# Altium project Daughterboard.PrjPcb
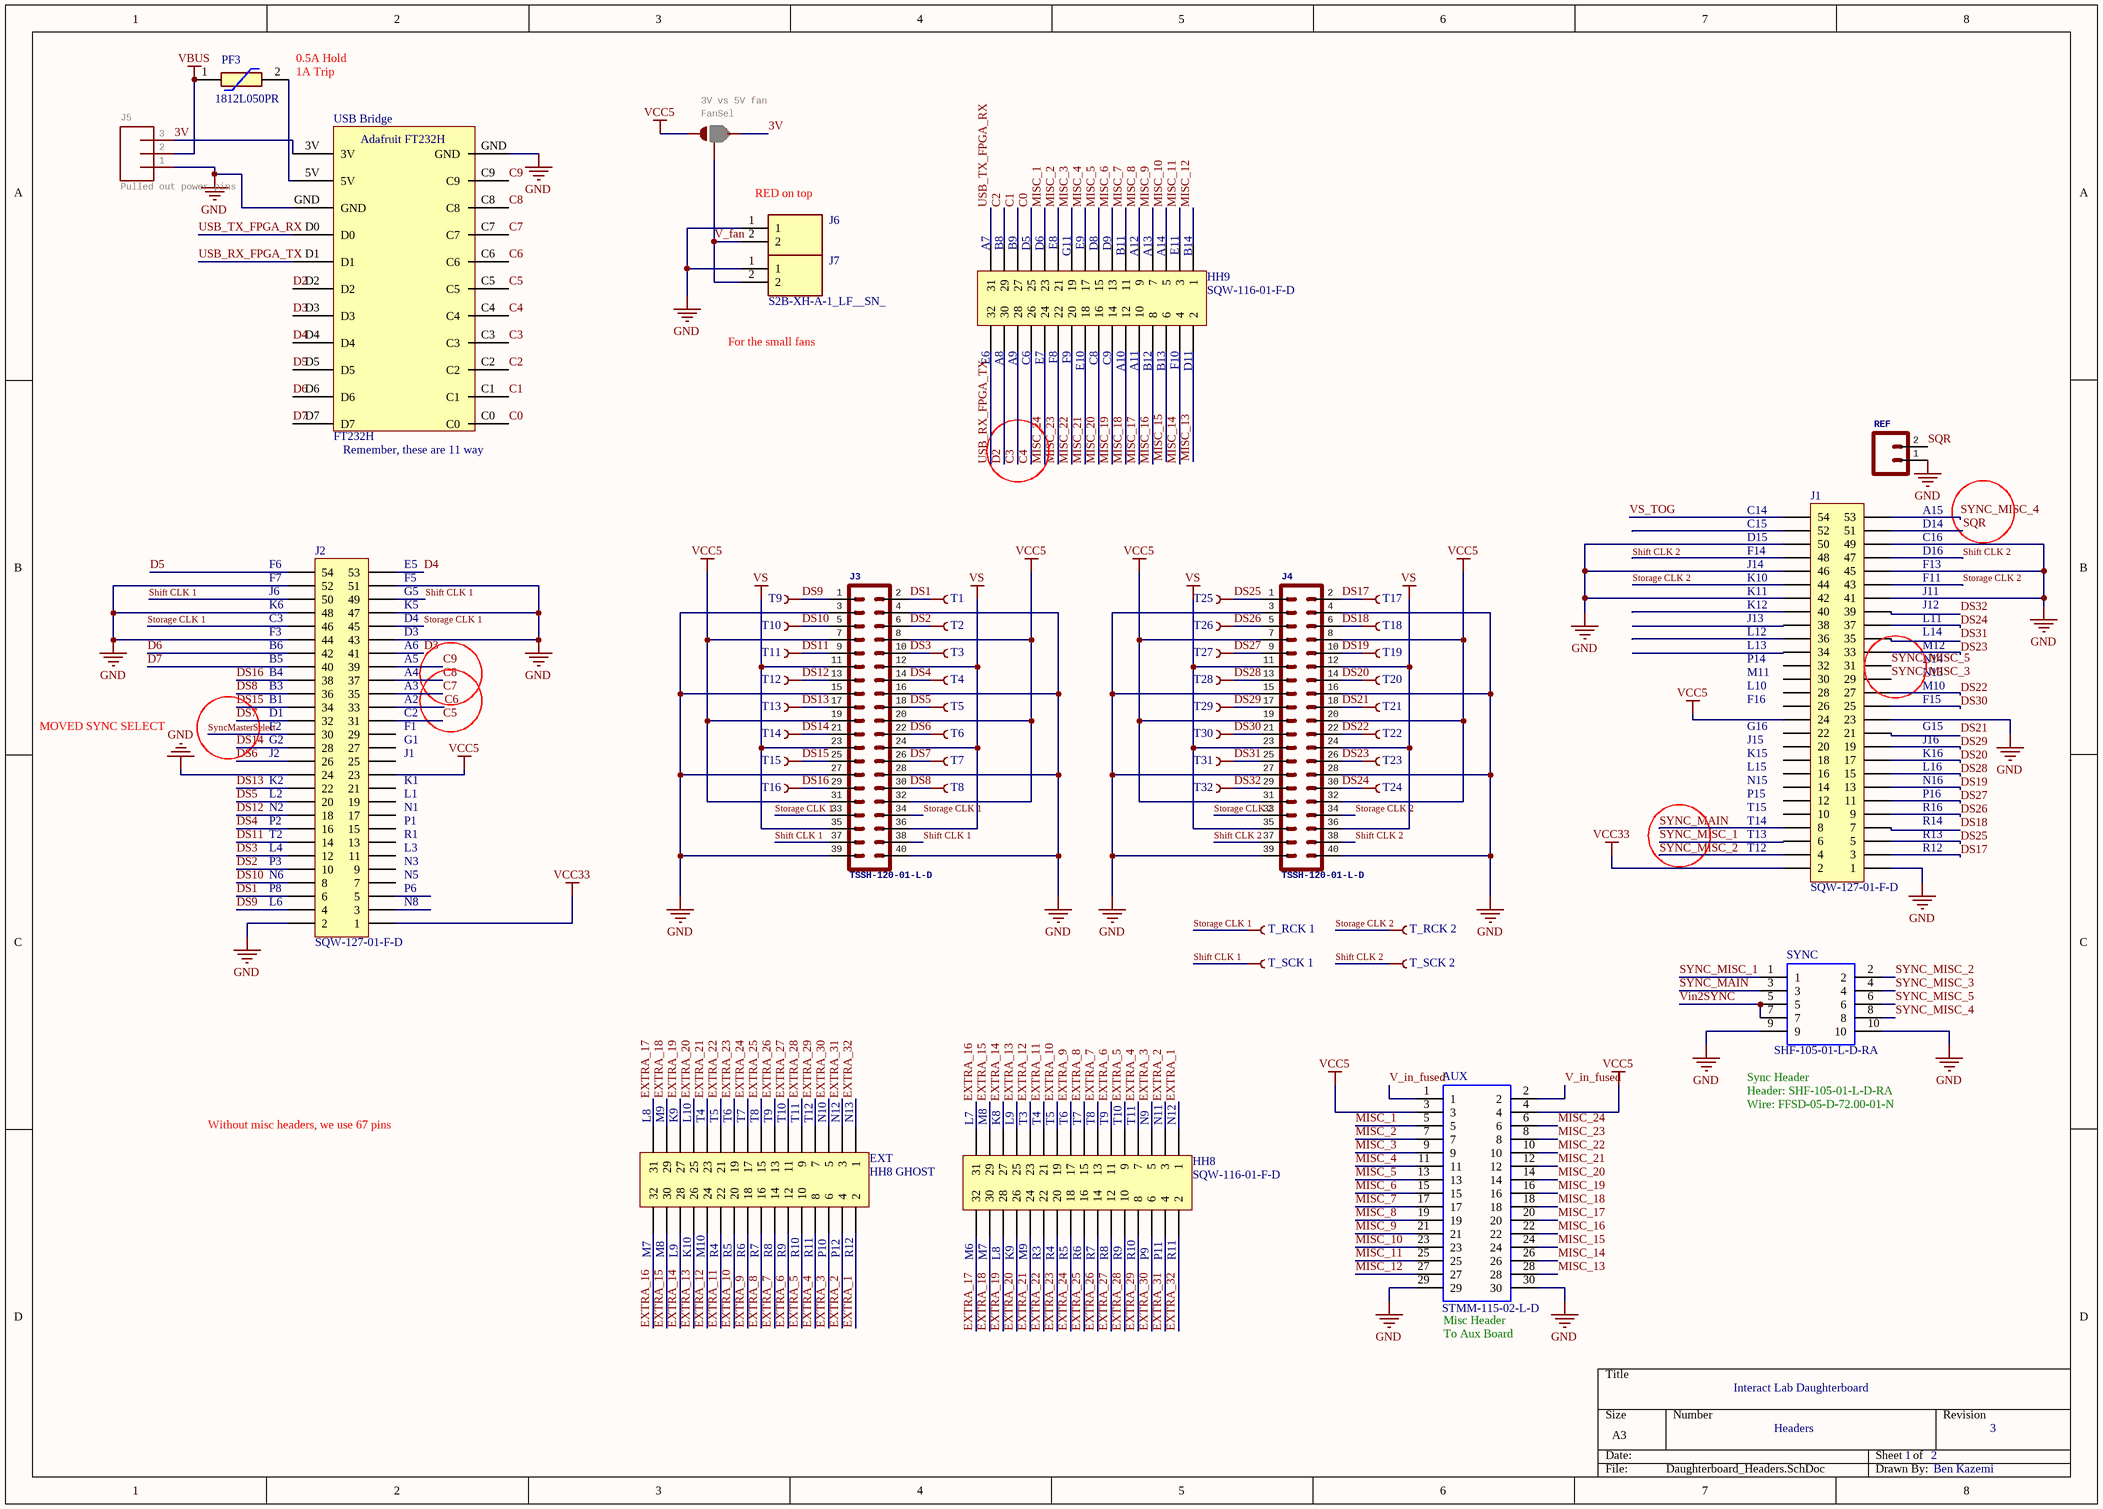
[diagram p0: Daughterboard_Headers.SchDoc]
2 sheets, 83 parts. Net scope: global (net labels, ports and power ports of the same name join across sheets).
Board file: Daughterboard_PCB.PcbDoc
Sheets:
  Daughterboard_Headers.SchDoc
  Daughterboard_Power.SchDoc

## Sheet Daughterboard_Headers.SchDoc: Interact Lab Daughterboard
size A3; DrawnBy: Ben Kazemi; Revision: 1; SheetNumber: 1; SheetTotal: 2; Number: Headers; ProjectName: Headers

### Parts
AUX  STMM-115-02-L-D  [STMM-115-02-L-D]
EXT  HH8 GHOST  [HDR2X16]
FanSel  3V vs 5V fan  [SMT-JUMPER_3_1-NC_PASTE_SILK]
HH8  SQW-116-01-F-D  [Header 16X2 - 2mm]
HH9  SQW-116-01-F-D  [Header 16X2 - 2mm]
J1  SQW-127-01-F-D  [Header 27X2 - 2mm]
J2  SQW-127-01-F-D  [Header 27X2 - 2mm]
J3  TSSH-120-01-L-D  [2X20_Socket]
J4  TSSH-120-01-L-D  [2X20_Socket]
J5  Pulled out power pins  [1X03]
J6  S2B-XH-A-1_LF__SN_  [S2BXHA1LFSN]  (value not drawn)
J7  S2B-XH-A-1_LF__SN_  [S2BXHA1LFSN]
PF3  1812L050PR  [1812L010DR]
REF  (no value)  [1X02_LOCK_]
SYNC  SHF-105-01-L-D-RA  [SHF-105-01-L-D-RA]
T1  TEST-POINT3X5  [PAD.03X.05]  (value not drawn)
T2  TEST-POINT3X5  [PAD.03X.05]  (value not drawn)
T3  TEST-POINT3X5  [PAD.03X.05]  (value not drawn)
T4  TEST-POINT3X5  [PAD.03X.05]  (value not drawn)
T5  TEST-POINT3X5  [PAD.03X.05]  (value not drawn)
T6  TEST-POINT3X5  [PAD.03X.05]  (value not drawn)
T7  TEST-POINT3X5  [PAD.03X.05]  (value not drawn)
T8  TEST-POINT3X5  [PAD.03X.05]  (value not drawn)
T9  TEST-POINT3X5  [PAD.03X.05]  (value not drawn)
T10  TEST-POINT3X5  [PAD.03X.05]  (value not drawn)
T11  TEST-POINT3X5  [PAD.03X.05]  (value not drawn)
T12  TEST-POINT3X5  [PAD.03X.05]  (value not drawn)
T13  TEST-POINT3X5  [PAD.03X.05]  (value not drawn)
T14  TEST-POINT3X5  [PAD.03X.05]  (value not drawn)
T15  TEST-POINT3X5  [PAD.03X.05]  (value not drawn)
T16  TEST-POINT3X5  [PAD.03X.05]  (value not drawn)
T17  TEST-POINT3X5  [PAD.03X.05]  (value not drawn)
T18  TEST-POINT3X5  [PAD.03X.05]  (value not drawn)
T19  TEST-POINT3X5  [PAD.03X.05]  (value not drawn)
T20  TEST-POINT3X5  [PAD.03X.05]  (value not drawn)
T21  TEST-POINT3X5  [PAD.03X.05]  (value not drawn)
T22  TEST-POINT3X5  [PAD.03X.05]  (value not drawn)
T23  TEST-POINT3X5  [PAD.03X.05]  (value not drawn)
T24  TEST-POINT3X5  [PAD.03X.05]  (value not drawn)
T25  TEST-POINT3X5  [PAD.03X.05]  (value not drawn)
T26  TEST-POINT3X5  [PAD.03X.05]  (value not drawn)
T27  TEST-POINT3X5  [PAD.03X.05]  (value not drawn)
T28  TEST-POINT3X5  [PAD.03X.05]  (value not drawn)
T29  TEST-POINT3X5  [PAD.03X.05]  (value not drawn)
T30  TEST-POINT3X5  [PAD.03X.05]  (value not drawn)
T31  TEST-POINT3X5  [PAD.03X.05]  (value not drawn)
T32  TEST-POINT3X5  [PAD.03X.05]  (value not drawn)
T_RCK_1  TEST-POINT3X5  [PAD.03X.05]  (value not drawn)
T_RCK_2  TEST-POINT3X5  [PAD.03X.05]  (value not drawn)
T_SCK_1  TEST-POINT3X5  [PAD.03X.05]  (value not drawn)
T_SCK_2  TEST-POINT3X5  [PAD.03X.05]  (value not drawn)
USB_Bridge  FT232H  [FT232H]

### Nets
GND: AUX.29 AUX.30 J1.1 J1.23 J1.41 J1.42 J1.45 J1.46 J1.49 J1.50 J2.2 J2.24 J2.43 J2.44 J2.47 J2.48 J2.51 J2.52 J3.3 J3.4 J3.15 J3.16 J3.27 J3.28 J3.39 J3.40 J4.3 J4.4 J4.15 J4.16 J4.27 J4.28 J4.39 J4.40 J5.1 J6.1 J7.1 REF.1 SYNC.9 SYNC.10 USB_Bridge.GND
VBUS: J5.2 PF3.1
VCC5: AUX.3 AUX.4 FanSel.1 J1.24 J2.23 J3.7 J3.8 J3.19 J3.20 J3.31 J3.32 J4.7 J4.8 J4.19 J4.20 J4.31 J4.32
VCC33: J1.2 J2.1
VS: J3.11 J3.12 J3.23 J3.24 J3.35 J3.36 J4.11 J4.12 J4.23 J4.24 J4.35 J4.36
3V: FanSel.3 J5.3 USB_Bridge.3V
C0: HH9.25 USB_Bridge.C0
C1: HH9.27 USB_Bridge.C1
C2: HH9.29 USB_Bridge.C2
C3: HH9.28 USB_Bridge.C3
C4: HH9.26 USB_Bridge.C4
C5: J2.31 USB_Bridge.C5
C6: J2.33 USB_Bridge.C6
C7: J2.35 USB_Bridge.C7
C8: J2.37 USB_Bridge.C8
C9: J2.39 USB_Bridge.C9
D2: HH9.30 USB_Bridge.D2
D3: J2.41 USB_Bridge.D3
D4: J2.53 USB_Bridge.D4
D5: J2.54 USB_Bridge.D5
D6: J2.42 USB_Bridge.D6
D7: J2.40 USB_Bridge.D7
DS1: J2.6 J3.2 T1.P$1
DS2: J2.10 J3.6 T2.P$1
DS3: J2.12 J3.10 T3.P$1
DS4: J2.16 J3.14 T4.P$1
DS5: J2.20 J3.18 T5.P$1
DS6: J2.26 J3.22 T6.P$1
DS7: J2.32 J3.26 T7.P$1
DS8: J2.36 J3.30 T8.P$1
DS9: J2.4 J3.1 T9.P$1
DS10: J2.8 J3.5 T10.P$1
DS11: J2.14 J3.9 T11.P$1
DS12: J2.18 J3.13 T12.P$1
DS13: J2.22 J3.17 T13.P$1
DS14: J2.28 J3.21 T14.P$1
DS15: J2.34 J3.25 T15.P$1
DS16: J2.38 J3.29 T16.P$1
DS17: J1.3 J4.2 T17.P$1
DS18: J1.7 J4.6 T18.P$1
DS19: J1.13 J4.10 T19.P$1
DS20: J1.17 J4.14 T20.P$1
DS21: J1.21 J4.18 T21.P$1
DS22: J1.27 J4.22 T22.P$1
DS23: J1.33 J4.26 T23.P$1
DS24: J1.37 J4.30 T24.P$1
DS25: J1.5 J4.1 T25.P$1
DS26: J1.9 J4.5 T26.P$1
DS27: J1.11 J4.9 T27.P$1
DS28: J1.15 J4.13 T28.P$1
DS29: J1.19 J4.17 T29.P$1
DS30: J1.25 J4.21 T30.P$1
DS31: J1.35 J4.25 T31.P$1
DS32: J1.39 J4.29 T32.P$1
EXTRA_1: EXT.2 HH8.1
EXTRA_2: EXT.4 HH8.3
EXTRA_3: EXT.6 HH8.5
EXTRA_4: EXT.8 HH8.7
EXTRA_5: EXT.10 HH8.9
EXTRA_6: EXT.12 HH8.11
EXTRA_7: EXT.14 HH8.13
EXTRA_8: EXT.16 HH8.15
EXTRA_9: EXT.18 HH8.17
EXTRA_10: EXT.20 HH8.19
EXTRA_11: EXT.22 HH8.21
EXTRA_12: EXT.24 HH8.23
EXTRA_13: EXT.26 HH8.25
EXTRA_14: EXT.28 HH8.27
EXTRA_15: EXT.30 HH8.29
EXTRA_16: EXT.32 HH8.31
EXTRA_17: EXT.31 HH8.32
EXTRA_18: EXT.29 HH8.30
EXTRA_19: EXT.27 HH8.28
EXTRA_20: EXT.25 HH8.26
EXTRA_21: EXT.23 HH8.24
EXTRA_22: EXT.21 HH8.22
EXTRA_23: EXT.19 HH8.20
EXTRA_24: EXT.17 HH8.18
EXTRA_25: EXT.15 HH8.16
EXTRA_26: EXT.13 HH8.14
EXTRA_27: EXT.11 HH8.12
EXTRA_28: EXT.9 HH8.10
EXTRA_29: EXT.7 HH8.8
EXTRA_30: EXT.5 HH8.6
EXTRA_31: EXT.3 HH8.4
EXTRA_32: EXT.1 HH8.2
MISC_1: AUX.5 HH9.23
MISC_2: AUX.7 HH9.21
MISC_3: AUX.9 HH9.19
MISC_4: AUX.11 HH9.17
MISC_5: AUX.13 HH9.15
MISC_6: AUX.15 HH9.13
MISC_7: AUX.17 HH9.11
MISC_8: AUX.19 HH9.9
MISC_9: AUX.21 HH9.7
MISC_10: AUX.23 HH9.5
MISC_11: AUX.25 HH9.3
MISC_12: AUX.27 HH9.1
MISC_13: AUX.28 HH9.2
MISC_14: AUX.26 HH9.4
MISC_15: AUX.24 HH9.6
MISC_16: AUX.22 HH9.8
MISC_17: AUX.20 HH9.10
MISC_18: AUX.18 HH9.12
MISC_19: AUX.16 HH9.14
MISC_20: AUX.14 HH9.16
MISC_21: AUX.12 HH9.18
MISC_22: AUX.10 HH9.20
MISC_23: AUX.8 HH9.22
MISC_24: AUX.6 HH9.24
Shift CLK 1: J2.49 J2.50 J3.37 J3.38 T_SCK_1.P$1
Shift CLK 2: J1.47 J1.48 J4.37 J4.38 T_SCK_2.P$1
SQR: J1.51 REF.2
Storage CLK 1: J2.45 J2.46 J3.33 J3.34 T_RCK_1.P$1
Storage CLK 2: J1.43 J1.44 J4.33 J4.34 T_RCK_2.P$1
SYNC_MAIN: J1.8 SYNC.3
SYNC_MISC_1: J1.6 SYNC.1
SYNC_MISC_2: J1.4 SYNC.2
SYNC_MISC_3: J1.29 SYNC.4
SYNC_MISC_4: J1.53 SYNC.8
SYNC_MISC_5: J1.31 SYNC.6
SyncMasterSelect: J2.30
USB_RX_FPGA_TX: HH9.32 USB_Bridge.D1
USB_TX_FPGA_RX: HH9.31 USB_Bridge.D0
V_fan: FanSel.2 J6.2 J7.2
V_in_fused: AUX.1 AUX.2
Vin2SYNC: SYNC.5 SYNC.7
VS_TOG: J1.54
NetPF3_2: PF3.2 USB_Bridge.5V

Not connected (* = marked no-connect by the designer): J1 10 12 14 16 18 20 22 26 28 30 32 34 36 38 40 52; J2 3 5 7 9 11 13 15 17 19 21 25 27 29

### Notes on the sheet
- (near PF3) 0.5A Hold
- (near PF3) 1A Trip
- (near J6) RED on top
- (near HH9) A7
- (near HH9) B8
- (near HH9) B9
- (near HH9) D5
- (near HH9) D6
- (near HH9) E8
- (near HH9) G11
- (near HH9) E9
- (near HH9) D8
- (near HH9) D9
- (near HH9) B11
- (near HH9) A12
- (near HH9) A13
- (near HH9) A14
- (near HH9) E11
- (near HH9) B14
- For the small fans
- (near HH9) E6
- (near HH9) A8
- (near HH9) A9
- (near HH9) C6
- (near HH9) E7
- (near HH9) F8
- (near HH9) F9
- (near HH9) E10
- (near HH9) C8
- (near HH9) C9
- (near HH9) A10
- (near HH9) A11
- (near HH9) B12
- (near HH9) B13
- (near HH9) F10
- (near HH9) D11
- (near USB_Bridge) Remember, these are 11 way
- (near J1) C14
- A15
- (near J2) F6
- (near J2) F7
- (near J2) F5
- (near J2) E5
- (near J1) C15
- (near J1) D15
- (near J1) F14
- (near J1) J14
- (near J1) K10
- F11
- F13
- D16
- C16
- D14
- (near J2) J6
- (near J2) K6
- (near J2) C3
- (near J2) F3
- (near J2) B6
- (near J2) A6
- (near J2) D3
- (near J2) D4
- (near J2) K5
- (near J2) G5
- (near J1) L12
- (near J1) L13
- (near J1) J13
- (near J1) K11
- (near J1) K12
- M12
- L14
- L11
- J12
- J11
- (near J2) B5
- (near J2) B4
- (near J2) B3
- (near J2) B1
- (near J2) D1
- (near J2) C2
- (near J2) A2
- (near J2) A3
- (near J2) A4
- (near J2) A5
- (near J1) F16
- (near J1) L10
- (near J1) M11
- (near J1) P14
- F15
- M10
- N13
- N14
- MOVED SYNC SELECT
- (near J2) F2
- (near J2) G2
- (near J2) J2
- (near J2) K2
- (near J2) K1
- (near J2) J1
- (near J2) G1
- (near J2) F1
- (near J1) N15
- (near J1) L15
- (near J1) K15
- (near J1) J15
- (near J1) G16
- N16
- L16
- K16
- J16
- G15
- (near J2) L4
- (near J2) T2
- (near J2) P2
- (near J2) N2
- (near J2) L2
- (near J2) L3
- (near J2) R1
- (near J2) P1
- (near J2) N1
- (near J2) L1
- (near J1) T12
- (near J1) T13
- (near J1) T14
- (near J1) T15
- (near J1) P15
- R12
- R13
- R14
- R16
- P16
- (near J2) L6
- (near J2) P8
- (near J2) N6
- (near J2) P3
- (near J2) N8
- (near J2) P6
- (near J2) N3
- (near J2) N5
- Without misc headers, we use 67 pins
- (near EXT) L8
- (near EXT) M9
- (near EXT) K9
- (near EXT) L10
- (near EXT) T4
- (near EXT) T5
- (near EXT) T6
- (near EXT) T7
- (near EXT) T8
- (near EXT) T9
- (near EXT) T10
- (near EXT) T11
- (near EXT) T12
- (near EXT) N10
- (near EXT) N12
- (near EXT) N13
- (near HH8) L7
- (near HH8) M8
- (near HH8) K8
- (near HH8) L9
- (near HH8) T3
- (near HH8) T4
- (near HH8) T5
- (near HH8) T6
- (near HH8) T7
- (near HH8) T8
- (near HH8) T9
- (near HH8) T10
- (near HH8) T11
- (near HH8) N9
- (near HH8) N11
- (near HH8) N12
- (near SYNC) Sync Header
- Header: SHF-105-01-L-D-RA
- Wire: FFSD-05-D-72.00-01-N
- (near EXT) M7
- (near EXT) M8
- (near EXT) L9
- (near EXT) K10
- (near EXT) M10
- (near EXT) R4
- (near EXT) R5
- (near EXT) R6
- (near EXT) R7
- (near EXT) R8
- (near EXT) R9
- (near EXT) R10
- (near EXT) R11
- (near EXT) P10
- (near EXT) P12
- (near EXT) R12
- (near HH8) M6
- (near HH8) M7
- (near HH8) L8
- (near HH8) K9
- (near HH8) M9
- (near HH8) R3
- (near HH8) R4
- (near HH8) R5
- (near HH8) R6
- (near HH8) R7
- (near HH8) R8
- (near HH8) R9
- (near HH8) R10
- (near HH8) P9
- (near HH8) P11
- (near HH8) R11
- (near AUX) Misc Header
- (near AUX) To Aux Board
- 3
- (in symbol FT232H) Adafruit FT232H

### Library data of the parts
AUX = STMM-115-02-L-D: Samtec STMM Series, Series Number 115, 2mm Pitch 30 Way 2 Row Straight PCB Header, Solder Termination; Geometry.Height: 4.8mm; Manufacturer_Name: SAMTEC; Manufacturer_Part_Number: STMM-115-02-L-D; RS Part Number: 9012513; RS Price/Stock: http://uk.rs-online.com/web/p/products/9012513; Mouser Part Number: 200-STMM11502LD; Mouser Price/Stock: https://www.mouser.com/Search/Refine.aspx?Keyword=200-STMM11502LD; Datasheet Link: http://suddendocs.samtec.com/catalog_english/stmm.pdf
EXT HH8 HH9 = Header 16X2: Header, 16-Pin, Dual row; LatestRevisionDate: 17-Jul-2002; LatestRevisionNote: Re-released for DXP Platform.; Publisher: Altium Limited
FanSel = JUMPER-SMT_3_1-NC_PASTE_SILK: GateName_1: G$1; SymbolName_1: SMT-JUMPER_3_1-NC_PASTE; DeviceName: _SILK; LibraryName: SparkFun-Jumpers; DeviceSetName: JUMPER-SMT_3_1-NC_PASTE; Package: SMT-JUMPER_3_1-NC_PASTE_SILK
J1 J2 = Header 27x2: Header, 30-Pin, Dual row
J3 J4 = CONN_20X2
J5 = CONN_03: GateName_1: J$1; PROD_ID: XXX-00000; SymbolName_1: CONN_03; LibraryName: SparkFun-Connectors; DeviceSetName: CONN_03; Package: 1X03
J6 J7 = S2B-XH-A-1_LF__SN_: Connector; Manufacturer_Name: JST (JAPAN SOLDERLESS TERMINALS); Manufacturer_Part_Number: S2B-XH-A-1(LF)(SN); Datasheet Link: http://www.jst-mfg.com/product/pdf/eng/eXH.pdf; Height: 6.1mm
PF3 = 1812L050PR: Resettable Fuse; Manufacturer_Name: LITTELFUSE; Datasheet Link: http://www.littelfuse.com/~/media/electronics/datasheets/resettable_ptcs/littelfuse_ptc_1812l_datasheet.pdf.pdf; Height: 1.25mm; Manufacturer_Part_Number: 1812L050PR; Mouser Part Number: 576-1812L050PR; Mouser Price/Stock: https://www.mouser.co.uk/ProductDetail/Littelfuse/1812L050PR?qs=PWhpLWeW8wetL6yrmAPPxg%3D%3D; Arrow Part Number: 1812L050PR; Arrow Price/Stock: https://www.arrow.com/en/products/1812l050pr/littelfuse
REF = CONN_02LOCK
SYNC = 1.27mm Header 2x05 SHF-105-01-L-D-RA: SHF 1.27mm R/A shrouded PCB header, 10P Samtec SHF Series, 1.27mm Pitch 10 Way 2 Row Shrouded Right Angle PCB Header, Through Hole, Solder Termination; RS Part Number: 9011850; Manufacturer_Name: SAMTEC; Manufacturer_Part_Number: SHF-105-01-L-D-RA; Datasheet Link: http://uk.rs-online.com/web/p/products/9011850

## Sheet Daughterboard_Power.SchDoc: Interact Lab Daughterboard
size A4; DrawnBy: Ben Kazemi; Revision: 1; SheetNumber: 2; SheetTotal: 2; number: Power
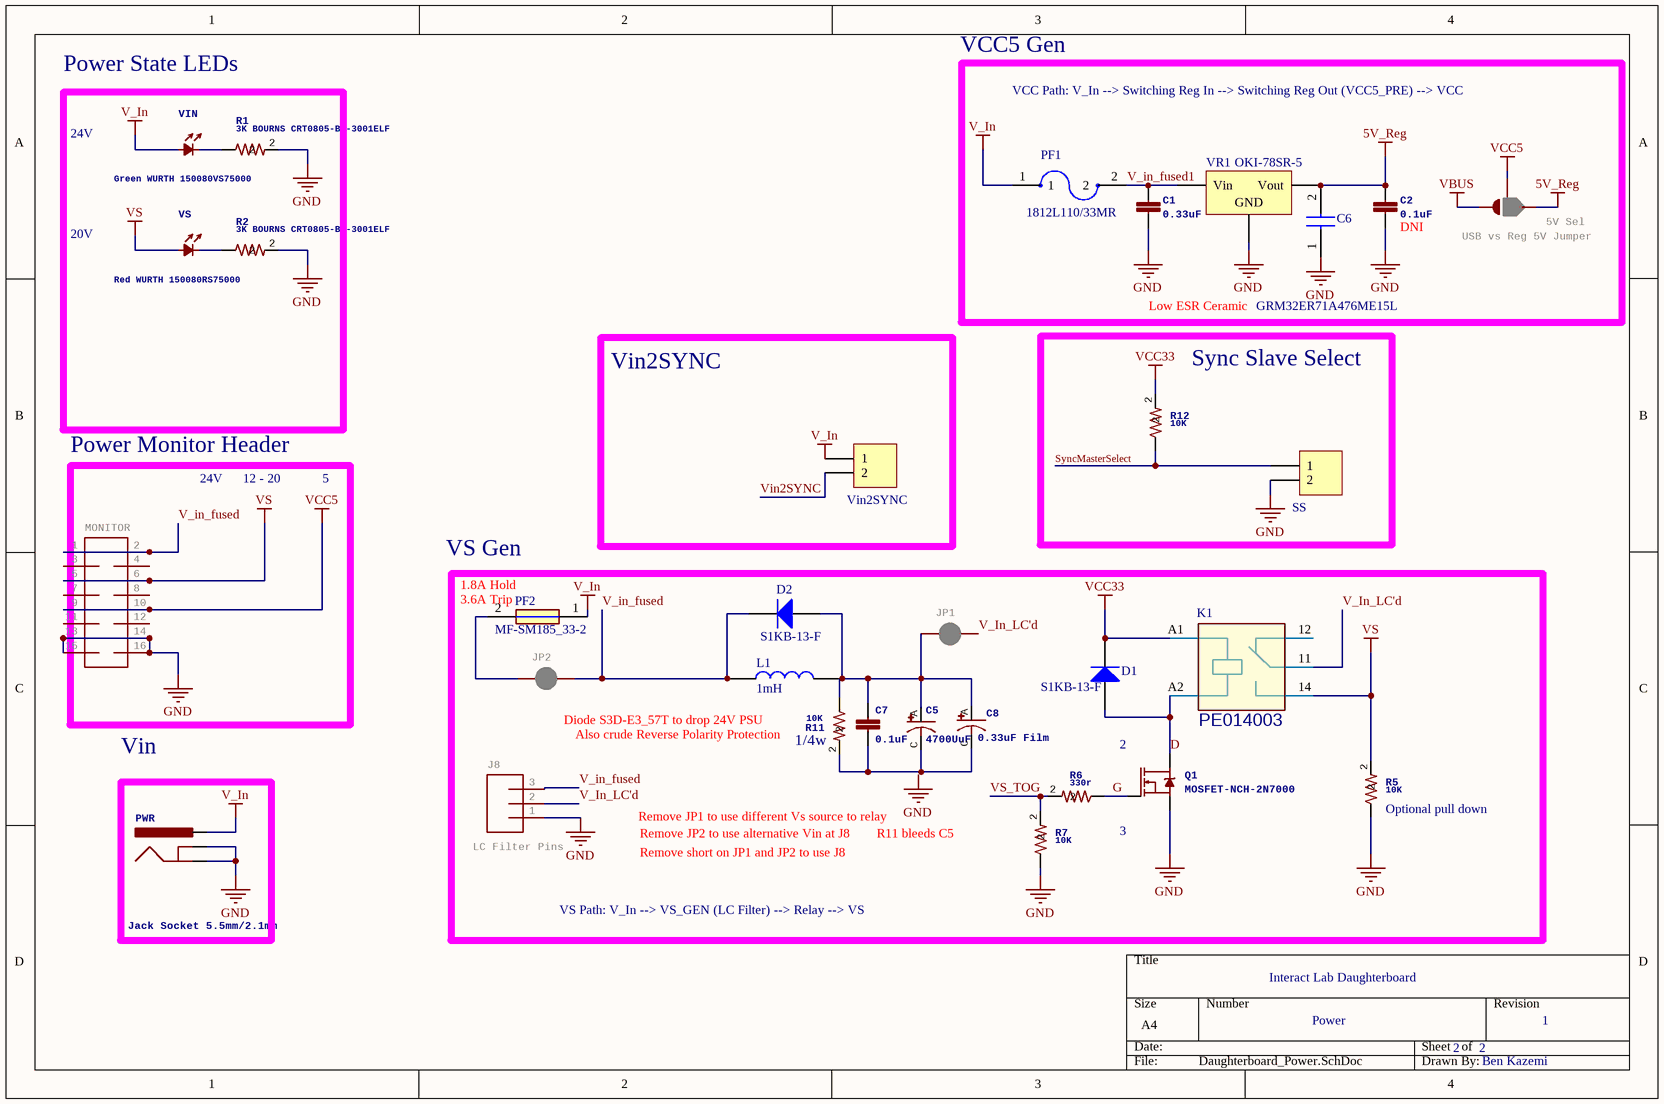
[diagram p1: Daughterboard_Power.SchDoc]

### Parts
5V_Sel  USB vs Reg 5V Jumper  [SMT-JUMPER_3_1-NC_PASTE_SILK]
C1  0.33uF  [CAP0805]
C2  0.1uF  [CAP0805]
C5  4700UuF  [CAP-PTH-10MM PITCH 22M]
C6  GRM32ER71A476ME15L  [CAPC3225X270N]
C7  0.1uF  [CAP0805]
C8  0.33uF Film  [R82DC3330AA60K Film Cap]
D1  S1KB-13-F  [SMB-DIODE]
D2  S1KB-13-F  [SMB-DIODE]
J8  LC Filter Pins  [1X03]
JP1  (no value)  [SMT-JUMPER_2_NC_PASTE_SILK]
JP2  (no value)  [SMT-JUMPER_2_NC_PASTE_SILK]
K1  PE014003  [SPDT Power Relay]
L1  1mH  [INDUCTOR Hor 2324VRC]
MONITOR  Multi connection point. Often used as Generic Header-pin footprint for 0.1 inch spaced/style header connections    You can populate with any combo of single row headers, but if you'd like an exact match, check this:  Header - 2x8 (Male, 0.1") (PRT-13156)       On any of the 0.1 inch spaced packages, you can populate with these:  Break Away Headers - Straight (PRT-00116)   Break Away Male Headers - Right Angle (PRT-00553)   Female Headers (PRT-00115)   Break Away Headers - Machine Pin (PRT-00117)   Break Away Female Headers - Swiss Machine Pin (PRT-00743)  [2X8_NOSILK]  (value not drawn)
PF1  1812L110/33MR  [Polyfuse]
PF2  MF-SM185_33-2  [FUSM8867X300N]
PWR  Jack Socket 5.5mm/2.1mm  [POWER_JACK_PTH_LOCK]
Q1  MOSFET-NCH-2N7000  [TO-92]
R1  3K BOURNS CRT0805-BY-3001ELF  [RES-0805]
R2  3K BOURNS CRT0805-BY-3001ELF  [RES-0805]
R5  10K  [RES-0805]
R6  330r  [RES-0805]
R7  10K  [RES-0805]
R11  10K  [RES-0805]
R12  10K  [RES-0805]
SS  (no value)  [HDR1X2]
VIN  Green WURTH 150080VS75000  [LED-0805 - GREEN]
Vin2SYNC  (no value)  [HDR1X2]
VR1  OKI-78SR-5  [OOKA-78SR]
VS  Red WURTH 150080RS75000  [LED-0805 - RED]

### Blocks framed on the sheet
Power State LEDs: R1 R2 VIN VS
VCC5 Gen: 5V_Sel C1 C2 C6 PF1 VR1
Vin2SYNC: Vin2SYNC
Sync Slave Select: R12 SS
Power Monitor Header: MONITOR
1/4w: C5 C7 C8 D1 D2 J8 JP1 JP2 K1 L1 PF2 Q1 R5-R7 R11

### Nets
5V_Reg: 5V_Sel.3 C2.1 C6.2 VR1.OUT(Vout)
GND: C1.2 C2.2 C6.1 J8.1 MONITOR.13 MONITOR.14 MONITOR.15 MONITOR.16 PWR.GND PWR.GNDBREAK Q1.1(S) R1.2 R2.2 R5.1 R7.1 SS.2 VR1.GND
V_In: PF1.1 PF2.1 PWR.PWR VIN.+ Vin2SYNC.1
VBUS: 5V_Sel.1
VCC5: 5V_Sel.2 MONITOR.9 MONITOR.10
VCC33: D1.C K1.A1 R12.2
VS: K1.14 MONITOR.5 MONITOR.6 R5.2 VS.+
D: D1.A K1.A2 Q1.3(D)
G: Q1.2(G) R6.1
SyncMasterSelect: R12.1 SS.1
V_in_fused: D2.C J8.3 JP2.2 L1.1 MONITOR.1 MONITOR.2
V_in_fused1: C1.1 PF1.2 VR1.IN(Vin)
V_In_LC'd: J8.2 JP1.2 K1.11
Vin2SYNC: Vin2SYNC.2
VS_TOG: R6.2 R7.2
NetC5_A: C5.A C7.1 C8.A D2.A JP1.1 L1.2 R11.1
NetC5_C: C5.C C7.2 C8.C R11.2
NetJP2_1: JP2.1 PF2.2
NetR1_1: R1.1 VIN.-
NetR2_1: R2.1 VS.-

Not connected (* = marked no-connect by the designer): K1 12; MONITOR 3 4 7 8 11 12

### Notes on the sheet
- VCC Path: V_In --> Switching Reg In --> Switching Reg Out (VCC5_PRE) --> VCC
- 24V
- 20V
- (near C2) DNI
- Low ESR Ceramic
- 12 - 20
- 5
- (near PF2) VS Gen
- (near PF2) 1.8A Hold
- (near PF2) 3.6A Trip
- Vin
- Diode S3D-E3_57T to drop 24V PSU
- (near R11) Also crude Reverse Polarity Protection
- (near Q1) 2
- Remove JP1 to use different Vs source to relay
- Remove JP2 to use alternative Vin at J8
- R11 bleeds C5
- 3
- (near R5) Optional pull down
- Remove short on JP1 and JP2 to use J8
- VS Path: V_In --> VS_GEN (LC Filter) --> Relay --> VS
- Labels drawn without touching a wire or pin: GND

### Library data of the parts
5V_Sel = JUMPER-SMT_3_1-NC_PASTE_SILK: as FanSel on sheet Daughterboard_Headers; LibraryName: SparkFun-Jumpers; DeviceSetName: JUMPER-SMT_3_1-NC_PASTE; Package: SMT-JUMPER_3_1-NC_PASTE_SILK
C1 C2 C7 = CAP CERAMIC: PROD_ID: CAP-08280
C5 C8 = CAP ELECTRO: PROD_ID: CAP-09538
C6 = GRM32ER71A476ME15L: Capacitor; Manufacturer_Name: Murata Electronics; Datasheet Link: https://psearch.en.murata.com/capacitor/product/GRM32ER71A476ME15%23.html; Height: 2.7mm; Manufacturer_Part_Number: GRM32ER71A476ME15L; Mouser Part Number: 81-GRM32ER71A476ME5L; Mouser Price/Stock: https://www.mouser.co.uk/ProductDetail/Murata-Electronics/GRM32ER71A476ME15L?qs=xcCo%252BfWZmQV8JP9RObVeqA%3D%3D; Arrow Part Number: GRM32ER71A476ME15L; Arrow Price/Stock: https://www.arrow.com/en/products/grm32er71a476me15l/murata-manufacturing
D1 D2 = Diode SMB: 1 Amp General Purpose Rectifier; Published: 8-Jun-2000; LatestRevisionDate: 17-Jul-2002; LatestRevisionNote: Re-released for DXP Platform.; PackageReference: DO-41; Publisher: Altium Limited; PackageDescription: Diode, Axial; Body 5.2 x 2.7 mm (LxDia. max), Lead Dia. 0.86 mm (max); Code_JEDEC: DO-204-AL; DatasheetVersion: 1998; PackageVersion: Aug-1999; ComponentLink1Description: Manufacturer Link; ComponentLink1URL: http://www.fairchildsemi.com/; ComponentLink2Description: Datasheet; ComponentLink2URL: http://www.fairchildsemi.com/ds/1N%2F1N4001.pdf
J8 = CONN_03: GateName_1: J$1; PROD_ID: XXX-00000; SymbolName_1: CONN_03; LibraryName: SparkFun-Connectors; DeviceSetName: CONN_03; Package: 1X03
JP1 JP2 = JUMPER-SMT_2_NC_PASTE_SILK: GateName_1: G$1; SymbolName_1: SMT-JUMPER_2_NC_PASTE; DeviceName: _SILK; LibraryName: SparkFun-Jumpers; DeviceSetName: JUMPER-SMT_2_NC_PASTE; Package: SMT-JUMPER_2_NC_PASTE_SILK
K1 = Power Relay SPDT: MP: 1-1393219-0; Contact_Current_Rating_Max: 5 A; MF: TE Connectivity; Contact_Switching_Voltage_Max: 400 VAC; SnapEDA_Link: https://www.snapeda.com/parts/1-1393219-0/TE%20Connectivity/view-part/?ref=snap; Package: None; Availability: Unavailable; Price: None; TE_purchase_URL: https://www.te.com/usa-en/product-1-1393219-0.html?te_bu=Cor&te_type=disp&te_campaign=seda_glo_cor-seda-global-disp-prtnr-fy19-seda-model-bom-cta_sma-317_1&elqCampaignId=32493; Value: *
L1 = INDUCTOR 2324-V-RC: Bourns 1 mH +/-15% Leaded Inductor, 2.4A Idc, 300m Rdc 2300; Allied_Number: 70408237; Geometry.Height: 32mm; RS Part Number: 1729913; Manufacturer_Name: Bourns; Manufacturer_Part_Number: 2324-V-RC; Datasheet Link: http://uk.rs-online.com/web/p/products/1729913
MONITOR = CONN_08X2_NOSILK: GateName_1: J1; SymbolName_1: CONN_2X8; DeviceName: _NOSILK; LibraryName: SparkFun-Connectors; DeviceSetName: CONN_08X2; Package: 2X8_NOSILK
PF1 = 1812L110/33MR: PTC Resettable Fuse 1.1A_hold_ 1.95A_trip_ 33VDC 20A 0.8W 0.5s 0.06Ohm SMD Solder Pad 1812 T/R; MF: Littelfuse Inc.; Availability: Unavailable; Package: 1812 Littelfuse; Price: None; SnapEDA_Link: https://www.snapeda.com/parts/1812L110/33MR/Littelfuse%20Inc./view-part/?ref=snap; MP: 1812L110/33MR; Value: *
PF2 = MF-SM185_33-2: Fuse; Manufacturer_Name: Bourns; Manufacturer_Part_Number: MF-SM185/33-2; Datasheet Link: https://www.mouser.com/datasheet/2/54/bourns_mfsm-1159445.pdf; Height: 3mm; Mouser Part Number: 652-MF-SM185/33-2; Mouser Price/Stock: https://www.mouser.co.uk/ProductDetail/Bourns/MF-SM185-33-2?qs=lgDiYRnMSkaEGAwXdMV4ng%3D%3D; Arrow Part Number: MF-SM185/33-2; Arrow Price/Stock: https://www.arrow.com/en/products/mf-sm18533-2/bourns
PWR = POWER_JACKPTH_LOCK: PROD_ID: CONN-08197; SF_ID: PRT-00119
R1 R2 R5-R7 R11 R12 = RESISTOR: MPN: CRCW0603470RFKEA; MF: Vishay; OC_MOUSER: 71-CRCW0603-470-E3; PACKAGE: 0603; TYPE: Resistor
SS Vin2SYNC = Header 2: Header, 2-Pin; LatestRevisionDate: 17-Jul-2002; LatestRevisionNote: Re-released for DXP Platform.; Publisher: Altium Limited
VIN VS = LED: PACKAGE: 0805
  VIN: Datasheet: https://docs-emea.rs-online.com/webdocs/1302/0900766b81302e25.pdf
  VS: Datasheet: https://docs-emea.rs-online.com/webdocs/1302/0900766b81302e21.pdf
VR1 = Volt Reg: Voltage Regulator; Published: 24-Mar-1999; LatestRevisionDate: 29-May-2009; LatestRevisionNote: IPC-7351 Footprint Added.; PackageReference: D2PAK; Publisher: Altium Limited; PackageDescription: 3-Pin Transistor Outline Package 2.54 mm Pitch, 15.1 mm Lead Span; Datasheet: http://www.farnell.com/datasheets/1904473.pdf?_ga=2.85272922.296638663.1549285494-96194751.1546862067

## Nets that join several sheets
GND: Daughterboard_Headers (41 pins), Daughterboard_Power (17 pins)
VBUS: Daughterboard_Headers (J5.2 PF3.1), Daughterboard_Power (5V_Sel.1)
VCC5: Daughterboard_Headers (17 pins), Daughterboard_Power (5V_Sel.2 MONITOR.9 MONITOR.10)
VCC33: Daughterboard_Headers (J1.2 J2.1), Daughterboard_Power (D1.C K1.A1 R12.2)
VS: Daughterboard_Headers (12 pins), Daughterboard_Power (5 pins)
SyncMasterSelect: Daughterboard_Headers (J2.30), Daughterboard_Power (R12.1 SS.1)
V_in_fused: Daughterboard_Headers (AUX.1 AUX.2), Daughterboard_Power (6 pins)
Vin2SYNC: Daughterboard_Headers (SYNC.5 SYNC.7), Daughterboard_Power (Vin2SYNC.2)
VS_TOG: Daughterboard_Headers (J1.54), Daughterboard_Power (R6.2 R7.2)